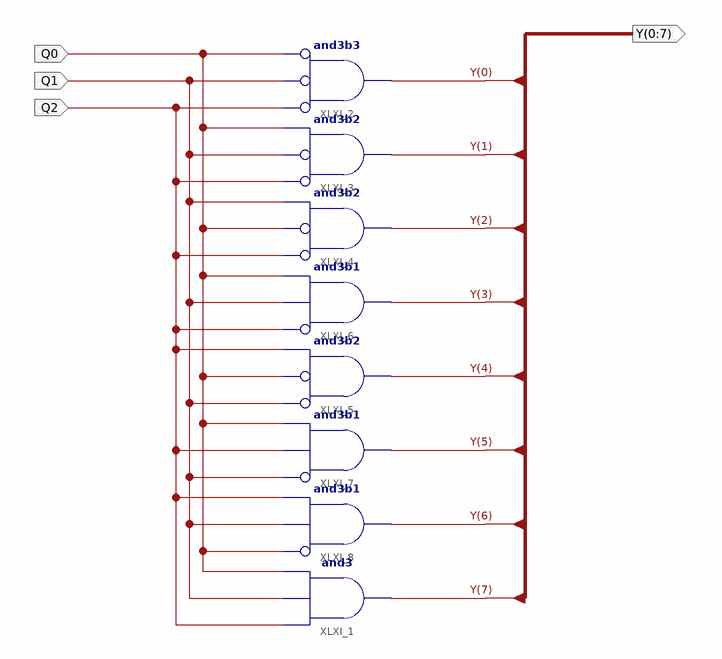
[diagram p0: schematic sheet 1]
// Xilinx ISE schematic decoder.sch (xc9500xl) as structural Verilog: 8 symbols, 4 ports
module decoder (
  input  Q0,
  input  Q1,
  input  Q2,
  output [0:7] Y
);

  and XLXI_2 (Y[0], ~Q2, ~Q1, ~Q0);  // and3b3
  and XLXI_3 (Y[1], ~Q2, ~Q1, Q0);  // and3b2
  and XLXI_4 (Y[2], ~Q2, ~Q0, Q1);  // and3b2
  and XLXI_6 (Y[3], ~Q2, Q1, Q0);  // and3b1
  and XLXI_5 (Y[4], ~Q1, ~Q0, Q2);  // and3b2
  and XLXI_7 (Y[5], ~Q1, Q2, Q0);  // and3b1
  and XLXI_8 (Y[6], ~Q0, Q1, Q2);  // and3b1
  and XLXI_1 (Y[7], Q2, Q1, Q0);
endmodule
